# EAGLE design untitled (EAGLE 9.6.2)
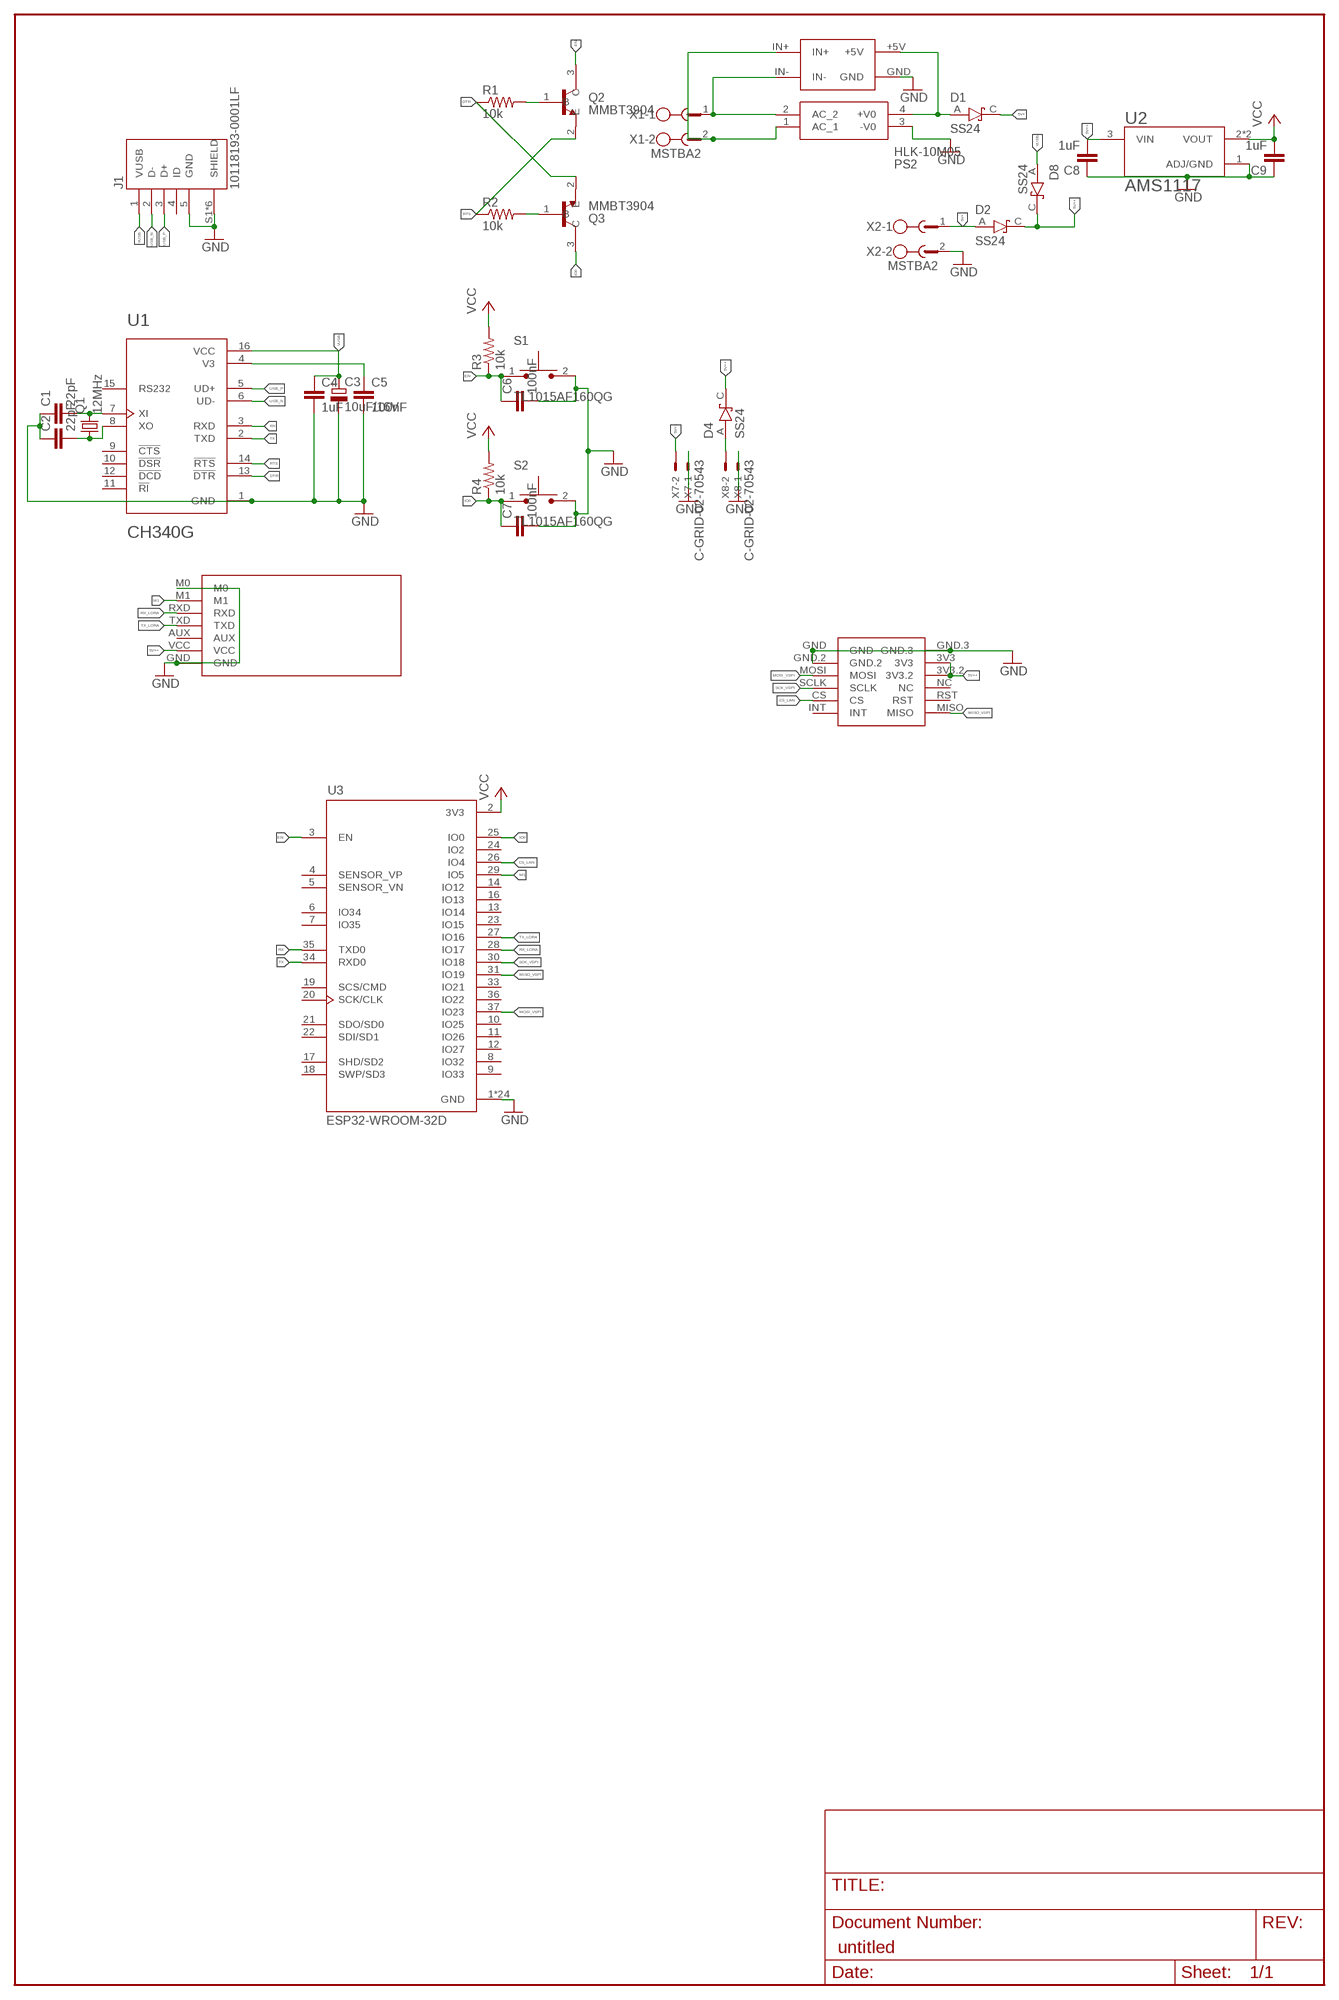
[diagram p0: schematic, sheet 1]

## Parts
C1  22pF  C-EUC0805K  [C0805K]
C2  22pF  C-EUC0805K  [C0805K]
C3  10uF/16V  CPOL-EU153CLV-0505  [153CLV-0505]
C4  1uF  C-EUC0805K  [C0805K]
C5  100nF  C-EUC0805K  [C0805K]
C6  100nF  C-EUC0805K  [C0805K]
C7  100nF  C-EUC0805K  [C0805K]
C8  1uF  C-EUC0805K  [C0805K]
C9  1uF  C-EUC0805K  [C0805K]
D1  SS24  [DIOM5336X265N]
D2  SS24  [DIOM5336X265N]
D4  SS24  [DIOM5336X265N]
D8  SS24  [DIOM5336X265N]
EBYTEE220-900T22D1  EBYTEE220-900T22D  [EBYTEE220-900T22D]
J1  10118193-0001LF  [FCI_10118193-0001LF]
PS2  HLK-10M05  [HLK10M05]
Q1  12MHz  CRYSTALSM49  [SM49]
Q2  MMBT3904  [SOT95P240X120-3N]
Q3  MMBT3904  [SOT95P240X120-3N]
R1  10k  R-US_M0805  [M0805]
R2  10k  R-US_M0805  [M0805]
R3  10k  R-US_M0805  [M0805]
R4  10k  R-US_M0805  [M0805]
S1  TL1015AF160QG  [SW_TL1015AF160QG]
S2  TL1015AF160QG  [SW_TL1015AF160QG]
SUPER-STEPDOWN1  SUPER-STEPDOWN  [SUPER-STEPDOWN]
U1  CH340G  [SOIC127P600X180-16N]
U2  AMS1117  [SOT229P700X180-4N]
U3  ESP32-WROOM-32D  [MODULE_ESP32-WROOM-32D]
U$1  MINI_W5500  [MINI_W5500]
X1  MSTBA2  [MSTBA2]
X2  MSTBA2  [MSTBA2]
X7  C-GRID-02-70543  [70543-02]
X8  C-GRID-02-70543  [70543-02]

## Nets
5V+: D1.C(K) D2.A X2.1 X7.2
5V++: C8.2 D2.C(K) D4.C(K) D8.C(K) EBYTEE220-900T22D1.VCC U2.3(VIN) U$1.3V3 U$1.3V3.2
CS_LAN: U3.26(IO4) U$1.CS
DTR: Q3.2(E) R1.1 U1.13(!DTR)
EN: C6.1 Q2.3(C) R3.1 S1.1 U3.3(EN)
GND(VERSION1): C1.1 C2.1 C3.- C4.2 C5.2 C6.2 C7.2 C8.1 C9.1 EBYTEE220-900T22D1.GND EBYTEE220-900T22D1.M0 J1.5(GND) J1.S1(SHIELD) J1.S2(SHIELD) J1.S3(SHIELD) J1.S4(SHIELD) J1.S5(SHIELD) J1.S6(SHIELD) PS2.3(-V0) S1.2 S2.2 SUPER-STEPDOWN1.GND U1.1(GND) U2.1(ADJ/GND) U3.1(GND) U3.15(GND) U3.38(GND) U3.39_1(GND) U3.39_2(GND) U3.39_3(GND) U3.39_4(GND) U3.39_5(GND) U3.39_6(GND) U3.39_7(GND) U3.39_8(GND) U3.39_9(GND) U3.39_10(GND) U3.39_11(GND) U3.39_12(GND) U3.39_13(GND) U3.39_14(GND) U3.39_15(GND) U3.39_16(GND) U3.39_17(GND) U3.39_18(GND) U3.39_19(GND) U3.39_20(GND) U3.39_21(GND) U$1.GND U$1.GND.2 U$1.GND.3 X2.2 X7.1 X8.1 ; supply symbol labelled GND
IO0: C7.1 Q3.3(C) R4.1 S2.1 U3.25(IO0)
M1: EBYTEE220-900T22D1.M1 U3.29(IO5)
MISO_VSPI: U3.31(IO19) U$1.MISO
MOSI_VSPI: U3.37(IO23) U$1.MOSI
N$1: PS2.2(AC_2) SUPER-STEPDOWN1.IN- X1.1
N$2: C5.1 U1.4(V3)
N$3: Q2.1(B) R1.2
N$4: C1.2 Q1.2 U1.7(XI)
N$5: C2.2 Q1.1 U1.8(XO)
N$6: Q3.1(B) R2.2
N$7: PS2.1(AC_1) SUPER-STEPDOWN1.IN+ X1.2
N$8: D1.A PS2.4(+V0) SUPER-STEPDOWN1.+5V
N$12: D4.A X8.2
RTS: Q2.2(E) R2.1 U1.14(!RTS)
RX: U1.3(RXD) U3.35(TXD0)
RX_LORA: EBYTEE220-900T22D1.RXD U3.28(IO17)
SCK_VSPI: U3.30(IO18) U$1.SCLK
TX: U1.2(TXD) U3.34(RXD0)
TX_LORA: EBYTEE220-900T22D1.TXD U3.27(IO16)
USB_N: J1.2(D-) U1.6(UD-)
USB_P: J1.3(D+) U1.5(UD+)
VCC: C9.2 R3.2 R4.2 U2.2(VOUT) U2.4(VOUT) U3.2(3V3)
VUSB: C3.+ C4.1 D8.A J1.1(VUSB) U1.16(VCC)
Unconnected: EBYTEE220-900T22D1.AUX J1.4(ID) U1.9(!CTS) U1.10(!DSR) U1.11(!RI) U1.12(!DCD) U1.15(RS232) U3.4(SENSOR_VP) U3.5(SENSOR_VN) U3.6(IO34) U3.7(IO35) U3.8(IO32) U3.9(IO33) U3.10(IO25) U3.11(IO26) U3.12(IO27) U3.13(IO14) U3.14(IO12) U3.16(IO13) U3.17(SHD/SD2) U3.18(SWP/SD3) U3.19(SCS/CMD) U3.20(SCK/CLK) U3.21(SDO/SD0) U3.22(SDI/SD1) U3.23(IO15) U3.24(IO2) U3.33(IO21) U3.36(IO22) U$1.INT U$1.NC U$1.RST

## Library data of the parts
C1 C2 C4-C9 = rcl:C-EU: CAPACITOR, European symbol; SPICEPREFIX: C
C3 = rcl:CPOL-EU: POLARIZED CAPACITOR, European symbol; SPICEPREFIX: C
D1 D2 D4 D8 = SS24:SS24: Diode Schottky 40V 2A Surface Mount DO-214AA (SMB) Check availability <https://pricing.snapeda.com/parts/SS24/ON%20Semiconductor/view-part?ref=eda>; AVAILABILITY: In Stock; CHECK_PRICES: https://www.snapeda.com/parts/SS24/Onsemi/view-part/?ref=eda; DESCRIPTION: Diode Schottky 40V 2A Surface Mount DO-214AA (SMB); MF: ON Semiconductor; MP: SS24; PACKAGE: DO-214AA ON Semiconductor; PRICE: None; SNAPEDA_LINK: https://www.snapeda.com/parts/SS24/Onsemi/view-part/?ref=snap
EBYTEE220-900T22D1 = EByte E220-900T22D:EBYTEE220-900T22D
J1 = 10118193-0001LF:10118193-0001LF: Micro USB B Type Receptacle Check availability <https://pricing.snapeda.com/parts/10118193-0001LF/FCI/view-part?ref=eda>; AVAILABILITY: In Stock; DESCRIPTION: USB - micro B USB 2.0 Receptacle Connector 5 Position Surface Mount, Right Angle; Through Hole; MF: FCI; MP: 10118193-0001LF; PACKAGE: None; PRICE: None; PURCHASE-URL: https://pricing.snapeda.com/search/part/10118193-0001LF/?ref=eda
PS2 = HLK-10M05:HLK-10M05: HI-LINK HLK-10M05 Manufacturer : HI-LINK <https://lcsc.com//brand-detail/11515.html> Mfr.Part # HLK-10M05 LCSC Part # C403745 <https://lcsc.com/product-detail/show_C403745.html> Package : Through Hole Datasheet :  EasyEDA Model <javascript:void(0);> Power Module AC-DC Through Hole RoHS Source: Datasheet <https://datasheet.lcsc.com/szlcsc/1909111105_HI-LINK-HLK-10M05_C403745.pdf> Check availability <https://pricing.snapeda.com/parts/HLK-10M05/Hi-link/view-part?ref=eda>; AVAILABILITY: Not in stock; DESCRIPTION: 10W Ultra-Compact Power Module; MF: Hi-link; MP: HLK-10M05; PACKAGE: Package; PRICE: None
Q1 = crystal:CRYSTAL: CRYSTAL; OC_FARNELL: unknown; OC_NEWARK: unknown
Q2 Q3 = MMBT3904:MMBT3904: MMBT3904 Series 40 V CE Breakdown 0.2 A NPN General Purpose Amplifier - SOT-23 Check availability <https://pricing.snapeda.com/parts/MMBT3904/ON%20Semiconductor/view-part?ref=eda>; AVAILABILITY: In Stock; DESCRIPTION: Bipolar (BJT) Transistor NPN 40 V 200 mA 300MHz 300 mW Surface Mount SOT-23-3 (TO-236); MF: ON Semiconductor; MP: MMBT3904; PACKAGE: SOT-23-3 Motorola; PRICE: None
R1-R4 = rcl:R-US_: RESISTOR, American symbol; SPICEPREFIX: R
S1 S2 = TL1015AF160QG:TL1015AF160QG: Tactile Switch SPST-NO Top Actuated Surface Mount Check availability <https://pricing.snapeda.com/parts/TL1015AF160QG/E-Switch/view-part?ref=eda>; AVAILABILITY: In Stock; DESCRIPTION: Tactile Switch SPST-NO Top Actuated Surface Mount; MF: E-Switch; MP: TL1015AF160QG; PACKAGE: None; PRICE: None; PURCHASE-URL: https://pricing.snapeda.com/search/part/TL1015AF160QG/?ref=eda
SUPER-STEPDOWN1 = SUPER-STEPDOWN:SUPER-STEPDOWN
U1 = CH340G:CH340G: Check availability <https://pricing.snapeda.com/parts/Ch340G/WCH/view-part?ref=eda>; AVAILABILITY: Not in stock; DESCRIPTION: USB Interface Integrated Circuit; MF: WCH; MP: Ch340G; PACKAGE: None; PRICE: None
U2 = AMS1117:AMS1117: Sot223/Pkg 1-Amp 5-Volt Low Drop Out Voltage Regulatator Check availability <https://pricing.snapeda.com/parts/AMS1117/Advanced%20Monolithic%20Systems/view-part?ref=eda>; AVAILABILITY: Not in stock; DESCRIPTION: 1A LOW DROPOUT VOLTAGE REGULATOR SOT-223; MF: Advanced Monolithic Systems; MP: AMS1117; PACKAGE: SOT-223 Seeed Technology; PRICE: None
U3 = ESP32-WROOM-32D:ESP32-WROOM-32D: Bluetooth, WiFi 802.11b/g/n, Bluetooth v4.2 + EDR, Class 1, 2 and 3 Transceiver Module 2.4GHz ~ 2.5GHz Integrated, Trace Surface Mount Check availability <https://pricing.snapeda.com/parts/ESP32-WROOM-32D/Espressif%20Systems/view-part?ref=eda>; AVAILABILITY: In Stock; DESCRIPTION: Bluetooth, WiFi 802.11b/g/n, Bluetooth v4.2 +EDR, Class 1, 2 and 3 Transceiver Module 2.4GHz ~ 2.5GHz Integrated; MF: Espressif Systems; MP: ESP32-WROOM-32D; PACKAGE: Module Espressif Systems; PRICE: None; PURCHASE-URL: https://pricing.snapeda.com/search/part/ESP32-WROOM-32D/?ref=eda
U$1 = ethernet-mikroavr:MINI_W5500: MINI ETHERNET W5500, CREATE BY MIKROAVR.COM
X1 X2 = con-phoenix-508:MSTBA2: PHOENIX; MF: FARNELL; MPN: 1757242; OC_FARNELL: 3705171; OC_NEWARK: 71C4161
X7 X8 = con-molex:C-GRID-02: CONNECTOR wire to board 2.54 mm (0.100") pitch header; MF: MOLEX; OC_FARNELL: unknown; OC_NEWARK: unknown

## Board
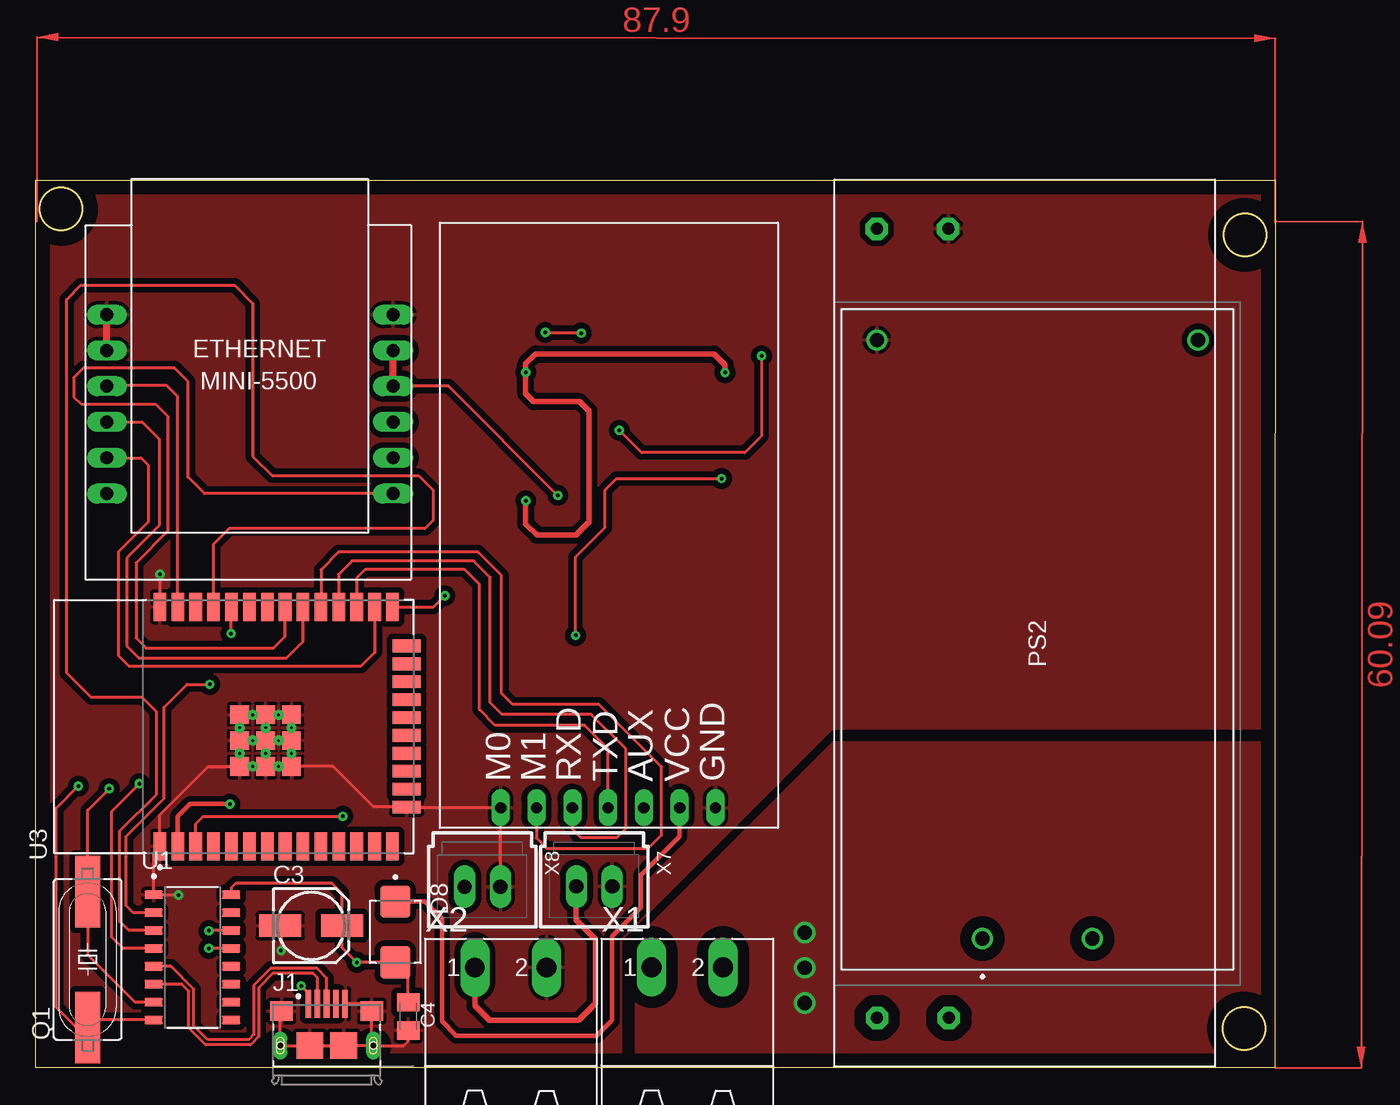
[diagram p1: board, top side]
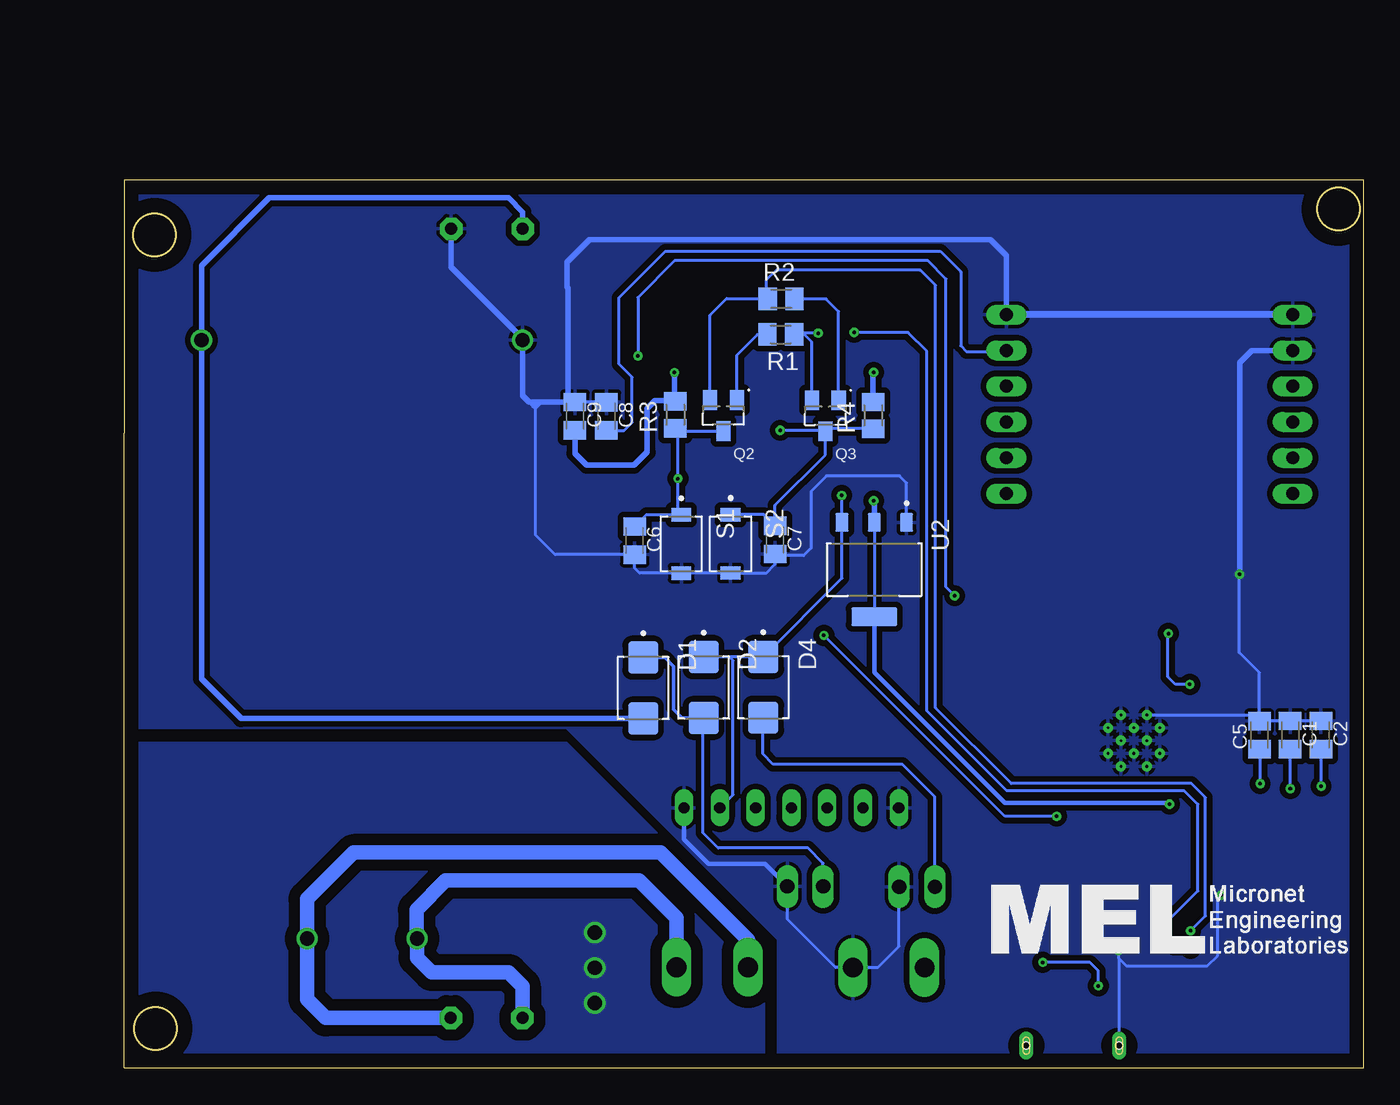
[diagram p2: board, bottom side, seen from below]

Size 88.01 x 63 mm. Coordinates in mm from the lower left corner, seen from the top.
Outline: 0,63 88,63 88,45.07 88.01,45.07 88.01,13.57 88,13.57 88,0 0,0 0,63
Outline: circle at 85.78,2.78 radius 1.5
Outline: circle at 85.85,59.13 radius 1.5
Outline: circle at 1.81,60.96 radius 1.5
Copper layers (1*16): Top 0.035mm / dielectric 1.5mm / Bottom 0.035mm
Design rules "default *": minimum track width 6mil, minimum drill 0.25mm, track to track 6mil, track to pad 6mil, pad to pad 6mil, via to via 6mil, smd to smd 6mil, copper to edge 40mil, drill to drill 6mil, minimum pad ring 10mil, minimum via ring 8mil, stop-mask expansion 4mil, vias tented up to drill 0mil, thermal gap 10mil

### Footprints (pad centres in the part's own frame; a part is rotated, then mirrored left to right if it is on the bottom)
C0805K = smd 1.3 x 1.6: 1 -1,0; 2 1,0
153CLV-0505 = smd 3 x 1.6: + 2.2,0; - -2.2,0
DIOM5336X265N = smd 2.29 x 2.12: A 2.16,0; C -2.16,0
EBYTEE220-900T22D = drill 0.8 pad 1.27 long: AUX -4.56,-10.98; GND -4.56,-16.06; M0 -4.56,-0.82; M1 -4.56,-3.36; RXD -4.56,-5.9; TXD -4.56,-8.44; VCC -4.56,-13.52
FCI_10118193-0001LF = smd 0.4 x 2: 1 -1.3,2.975; 2 -0.65,2.975; 3 0,2.975; 4 0.65,2.975; 5 1.3,2.975 | smd 1.6 x 1.4: S1 -3.2,2.45; S2 3.2,2.45 | smd 1.9 x 1.9: S3 1.2,0; S4 -1.2,0 | drill 0.5 pad 0.9 long: S5 -3.3,0; S6 3.3,0 | hole 0.5: -3.3,0; 3.3,0
HLK10M05 = drill 1 pad 1.5: 1 0,0; 2 0,-7.8; 3 42.5,7.5; 4 42.5,-15.3
SM49 = smd 5.08 x 1.778: 1 -4.826,0; 2 4.826,0
SOT95P240X120-3N = smd 1 x 1.4: 1 -0.95,-1.1; 2 0.95,-1.1; 3 0,1.1
M0805 = smd 1.3 x 1.6: 1 -0.95,0; 2 0.95,0
SW_TL1015AF160QG = smd 0.95 x 1.4: 1 -2.075,0; 2 2.075,0
SUPER-STEPDOWN = drill 0.85 pad 1.6 octagon: +5V 59.509,24.006; GND 59.509,18.926; IN+ 3.478,23.979; IN- 3.478,18.899
SOIC127P600X180-16N = smd 1.31 x 0.62: 1 -2.75,4.445; 2 -2.75,3.175; 3 -2.75,1.905; 4 -2.75,0.635; 5 -2.75,-0.635; 6 -2.75,-1.905; 7 -2.75,-3.175; 8 -2.75,-4.445; 9 2.75,-4.445; 10 2.75,-3.175; 11 2.75,-1.905; 12 2.75,-0.635; 13 2.75,0.635; 14 2.75,1.905; 15 2.75,3.175; 16 2.75,4.445
SOT229P700X180-4N = smd 1.31 x 0.93: 1 -3.345,2.29; 2 -3.345,0; 3 -3.345,-2.29 | smd 1.31 x 3.24: 4 3.345,0
MODULE_ESP32-WROOM-32D = smd 2 x 0.9: 1 -8.5,5.26; 2 -8.5,3.99; 3 -8.5,2.72; 4 -8.5,1.45; 5 -8.5,0.18; 6 -8.5,-1.09; 7 -8.5,-2.36; 8 -8.5,-3.63; 9 -8.5,-4.9; 10 -8.5,-6.17; 11 -8.5,-7.44; 12 -8.5,-8.71; 13 -8.5,-9.98; 14 -8.5,-11.25; 25 8.5,-11.25; 26 8.5,-9.98; 27 8.5,-8.71; 28 8.5,-7.44; 29 8.5,-6.17; 30 8.5,-4.9; 31 8.5,-3.63; 32 8.5,-2.36; 33 8.5,-1.09; 34 8.5,0.18; 35 8.5,1.45; 36 8.5,2.72; 37 8.5,3.99; 38 8.5,5.26 | smd 0.9 x 2: 15 -5.715,-12.25; 16 -4.445,-12.25; 17 -3.175,-12.25; 18 -1.905,-12.25; 19 -0.635,-12.25; 20 0.635,-12.25; 21 1.905,-12.25; 22 3.175,-12.25; 23 4.445,-12.25; 24 5.715,-12.25 | smd 1.33 x 1.33: 39_1 -2.835,-0.405; 39_2 -1,-0.405; 39_3 0.835,-0.405; 39_4 -2.835,-2.24; 39_5 -1,-2.24; 39_6 0.835,-2.24; 39_7 -2.835,-4.075; 39_8 -1,-4.075; 39_9 0.835,-4.075 | drill 0.2 pad 0.3: 39_10 -1.917,-0.405; 39_11 -0.083,-0.405; 39_12 -2.835,-1.323; 39_13 -1,-1.323; 39_14 0.835,-1.323; 39_15 -1.917,-2.24; 39_16 -0.083,-2.24; 39_17 -2.835,-3.158; 39_18 -1,-3.158; 39_19 0.835,-3.158; 39_20 -1.917,-4.075; 39_21 -0.083,-4.075
MINI_W5500 = drill 0.914 long: 3V3 21.844,-8.89; 3V3.2 21.844,-11.43; CS 1.524,-16.51; GND 1.524,-6.35; GND.2 1.524,-8.89; GND.3 21.844,-6.35; INT 1.524,-19.05; MISO 21.844,-19.05; MOSI 1.524,-11.43; NC 21.844,-13.97; RST 21.844,-16.51; SCLK 1.524,-13.97
MSTBA2 = drill 1.397 long: 1 -2.54,5.08; 2 2.54,5.08
70543-02 = drill 1.016 long: 1 -1.27,0; 2 1.27,0

### Placement (x,y rotation side)
C1  5.24,23.61 270 bottom
C2  3.05,23.62 270 bottom
C3  19.56,10.08 0 top
C4  26.46,3.65 270 top
C5  7.41,23.6 90 bottom
C6  51.78,37.42 270 bottom
C7  41.79,37.47 270 bottom
C8  53.77,46.25 270 bottom
C9  56.01,46.26 270 bottom
D1  51.16,26.95 270 bottom
D2  46.88,26.99 270 bottom
D4  42.63,27.01 270 bottom
D8  25.53,9.63 270 top
EBYTEE220-900T22D1  32.2,23.01 90 top
J1  20.66,1.56 0 top
PS2  67.22,9.16 90 top
Q1  3.7,7.69 90 top
Q2  45.47,46.3 180 bottom
Q3  38.23,46.28 180 bottom
R1  41.39,52.05 180 bottom
R2  41.38,54.58 0 bottom
R3  48.88,46.35 90 bottom
R4  34.84,46.31 90 bottom
S1  48.46,37.18 270 bottom
S2  44.96,37.19 270 bottom
SUPER-STEPDOWN1  83.72,0.05 90 top
U1  11.14,7.83 0 top
U2  34.76,35.36 270 bottom
U3  14.08,24.22 90 top
U$1  3.53,59.81 0 top
X1  46.26,2.05 0 top
X2  33.73,2.04 0 top
X7  39.66,12.87 180 top
X8  31.73,12.84 180 top

### Tracks (layer width: path | path; a pad name or v marks a point on that pad's centre or on a via)
5V+
  Top 0.406: X2.1 31.19,4.38 32.22,3.35 38.53,3.35 39.75,4.57 39.75,9.11 38.35,10.51 38.35,12.83 X7.2
  Bottom 0.203: D2.A 46.91,24.8 46.91,16.66 45.84,15.59 39.46,15.59 38.39,14.52 X7.2 | 51.15,29.13 D1.C
  Bottom 0.254: D2.A 48.4,24.83 49.01,25.44 49.01,28.5 49.62,29.11 D1.C
5V++  (via drill 0.25)
  Top 0.203: U$1.3V3.2 29.31,48.38 37.06,40.63 v37.08,40.63
  Top 0.305: EBYTEE220-900T22D1.VCC 45.72,16.43 42.97,13.68 42.97,11.38 40.93,9.34 40.93,3.37 39.82,2.26 29.86,2.26 28.84,3.28 28.84,10.61 27.63,11.82 25.55,11.82 D8.C
  Top 0.508: U$1.3V3.2 U$1.3V3
  Bottom 0.203: 45.04,29.17 D4.C 37.05,34.75 U2.3 37.05,40.6 v37.08,40.63 | 45.04,29.17 46.86,29.17 D2.C | EBYTEE220-900T22D1.VCC 44.78,19.38 44.78,28.91 45.04,29.17 | C8.2 52.51,45.24 51.95,45.81 51.95,49.03 52.88,49.96 52.88,54.67 49.59,57.96 30.07,57.96 28.62,56.51 28.62,51.25 28.2,50.83 25.46,50.83 U$1.3V3
CS_LAN
  Top 0.203: U$1.CS 7.48,43.3 8,42.78 8,38.74 5.87,36.62 5.87,29.26 6.62,28.51 23.1,28.51 24.1,29.51 24.1,32.68 U3.26
DTR  (via drill 0.25)
  Top 0.203: U1.13 v12.31,8.46 12.29,8.44 | v36.18,52.2 38.69,52.2 v38.74,52.15
  Bottom 0.203: Q3.2 39.18,51.53 39.71,52.05 R1.1 40.34,52.15 v38.74,52.15 | v12.31,8.46 13.5,8.46 14.07,9.03 14.07,10.27 11.79,12.55 11.79,18.7 12.75,19.66 25.35,19.66 31.02,25.33 31.02,50.86 32.36,52.2 v36.18,52.2
EN  (via drill 0.25)
  Top 0.203: U3.3 11.36,17.29 11.89,17.82 21.78,17.82 v21.8,17.85 | v38.34,30.69 38.34,36.27 40.41,38.35 40.41,41.01 41.23,41.82 v48.69,41.82 48.71,41.82
  Bottom 0.203: R3.1 48.69,45.21 | 48.69,45.21 48.69,45.2 Q2.3 | C6.1 50.93,39.26 S1.1 48.69,39.5 v48.69,41.82 48.69,45.21 | v21.8,17.85 25.47,17.85 38.31,30.69 v38.34,30.69
GND1  (via drill 1)
  other vias: 54.6,4.59 54.6,7.09 54.6,9.59
  pour Bottom (isolate 0.813): 42.6,0.09 88.1,0.09 88.1,23.09 56.6,23.09 42.6,9.09
  pour Top (isolate 0.813): 42.6,0.09 88.1,0.09 88.1,23.09 56.6,23.09 42.6,9.09
GND(VERSION1)  (via drill 0.25)
  Top 0.203: J1.S6 23.86,1.66 J1.S2 23.34,4.54 J1.5 | J1.S6 26.14,1.56 26.46,1.89 C4.2 | J1.S6 J1.S3 J1.S4 J1.S5 17.36,3.91 J1.S1 | U3.39_3 U3.39_14 U3.39_6 16.4,25.05 | U3.39_3 | 16.4,25.05 U3.39_19 18.15,25.05 | 18.15,25.05 U3.39_9 | 18.15,25.05 18.15,24.15 U3.39_21 U3.39_8 18,23.22 | 16.4,25.05 16.32,24.98 U3.39_16 U3.39_5 | U3.39_3 14.49,25.04 U3.39_11 14.49,23.25 | 14.49,23.25 U3.39_2 | 14.55,23.22 U3.39_13 U3.39_5 | 14.55,23.22 14.52,23.22 14.49,23.25 | U3.39_5 16.39,23.22 | 16.39,23.22 U3.39_18 18,23.22 | 18,23.22 18,22.46 U3.39_20 U3.39_7 | 16.39,23.22 16.32,23.15 U3.39_15 U3.39_4 | U3.39_4 U3.39_17 U3.39_7 | 14.55,23.22 14.49,23.16 U3.39_10 U3.39_1 | U3.39_1 U3.39_12 U3.39_4 | X8.1 33,18.42 EBYTEE220-900T22D1.M0 27.09,18.45 26.86,18.68 26.51,18.68 U3.15 24,18.5 21.12,21.38 U3.39_7 | U3.39_1 12.26,21.38 8.82,17.95 U3.1 8.39,15.28 U1.1 8.42,12.25 v10.13,12.25 | C3.- 17.43,10.01 v17.43,8.31 | v8.82,35.03 | v8.82,35.03 U3.38
  Top 0.508: U$1.GND.2 U$1.GND
  Bottom 0.2: 58.82,46.78 59,46.97 | 59,46.97 59.25,47.21 59.25,47.26 | 58.62,46.97 59,46.97
  Bottom 0.203: C8.1 56,47.24 C9.1 | C2.1 C1.1 C5.2 | U2.1 32.47,41.52 32.96,42.01 38.16,42.01 39.25,40.92 39.25,36.88 39.78,36.35 41.12,36.35 41.24,36.47 C7.2 41.8,35.75 42.42,35.12 S2.2 48.45,35.12 S1.2 51.41,35.11 51.78,35.47 C6.2 57.4,36.42 58.82,37.83 58.82,46.78 58.62,46.97 58.34,47.26 | v17.43,8.31 17.43,7.79 17.36,7.73 | 17.36,7.73 16.85,7.22 11.12,7.22 10.38,7.96 10.38,12 v10.13,12.25 | J1.S5 17.36,7.73 | U3.39_14 7.74,25.05 7.31,24.62 7.39,24.62 C5.2 | C5.2 7.41,28.04 8.85,29.48 8.85,35 v8.82,35.03 | X8.1 33,8.62 34.5,7.11 X2.2 37.51,7.11 40.93,10.53 X7.1
  Bottom 0.305: EBYTEE220-900T22D1.GND 48.26,16.21 46.51,14.46 42.52,14.46 X7.1
  Bottom 0.406: v8.82,35.03 8.82,50.07 7.97,50.92 U$1.GND.2 | U$1.GND.3 25.38,57.66 26.5,58.78 54.96,58.78 56.55,57.19 56.55,55.43 56.48,55.36 56.48,47.73 C9.1 58.34,47.26 59.25,47.26 59.72,47.73 PS2.3 59.72,51.76 64.8,56.83 SUPER-STEPDOWN1.GND
  Bottom 0.508: U$1.GND U$1.GND.3
  pour Top (isolate 0.406): 0.1,0.09 41.6,0.09 41.6,9.09 56.6,24.09 88.1,24.09 88.1,63.09 0.1,63.09
  pour Bottom (isolate 0.406): 0.1,0.09 41.6,0.09 41.6,9.09 56.6,24.09 88.1,24.09 88.1,63.09 0.1,63.09
IO0  (via drill 0.25)
  Top 0.203: U3.25 28.26,32.72 v29.05,33.5 | v51.53,50.54 51.53,44.85 50.34,43.65 43.03,43.65 v41.43,45.25
  Bottom 0.203: R4.1 38.06,45.36 Q3.3 | S2.1 42.59,39.27 C7.1 41.8,39.94 38.23,43.51 Q3.3 | v29.05,33.5 29.67,34.12 29.67,56 30.95,57.28 48.94,57.28 51.53,54.69 v51.53,50.54 | v41.43,45.25 38.3,45.25 Q3.3
M1
  Top 0.203: EBYTEE220-900T22D1.M1 35.56,16.3 36.29,15.57 43.48,15.57 44.44,16.52 44.44,21.36 40,25.8 33.86,25.8 33.08,26.58 33.08,34.93 31.39,36.61 21.52,36.61 20.25,35.34 U3.29
MISO_VSPI
  Top 0.203: U$1.MISO 12,40.76 10.83,41.93 10.83,48.7 9.86,49.66 3.37,49.66 2.72,49.01 2.72,47.63 3.25,47.1 8.54,47.1 9.39,46.25 9.39,38.1 7.12,35.84 7.12,30.51 7.85,29.79 16.89,29.79 17.71,30.61 U3.31
MOSI_VSPI
  Top 0.203: U3.37 10.09,47.64 9.29,48.44 5.12,48.44 U$1.MOSI
N$1
  Bottom 1.016: X1.1 43.72,9.08 49.92,15.28 71.72,15.28 75.02,11.97 PS2.2 75.03,9.15 75.03,4.86 73.7,3.53 SUPER-STEPDOWN1.IN-
N$2  (via drill 0.25)
  Top 0.203: U1.4 6.21,8.46 5.4,9.27 5.4,18.19 7.37,20.15 | 7.37,20.15 | 7.37,20.15 v7.36,20.16
  Bottom 0.203: v7.36,20.16 7.36,22.56 C5.1
N$3
  Bottom 0.203: Q2.1 44.52,50.59 43.06,52.05 R1.2
N$4  (via drill 0.25)
  Top 0.203: U1.7 7.06,4.65 3.69,8.02 3.69,12.5 Q1.2 3.7,18.28 v5.22,19.8
  Bottom 0.203: v5.22,19.8 5.22,22.6 C1.2
N$5  (via drill 0.25)
  Top 0.203: U1.8 4.22,3.38 Q1.1 2.87,2.86 1.45,4.28 1.45,18.41 v3.03,19.99
  Bottom 0.203: v3.03,19.99 3.03,22.6 C2.2
N$6
  Bottom 0.203: Q3.1 37.28,53.68 38.18,54.58 R2.2
N$7
  Bottom 1.016: X1.2 48.8,10.64 51.45,13.29 65.18,13.29 67.26,11.21 67.26,9.2 PS2.1 67.22,7.8 66.18,6.76 60.71,6.76 59.74,5.79 SUPER-STEPDOWN1.IN+
N$8
  Bottom 0.406: D1.A 79.71,24.79 82.52,27.6 PS2.4 82.52,56.93 77.7,61.75 60.73,61.75 59.72,60.74 SUPER-STEPDOWN1.+5V
N$12
  Bottom 0.203: X8.2 30.46,19.23 32.77,21.55 41.94,21.55 42.66,22.26 42.66,24.82 D4.A
RTS  (via drill 0.25)
  Top 0.203: U1.14 12.33,9.73 v12.31,9.72
  Bottom 0.203: Q2.2 46.42,53.43 45.24,54.61 42.43,54.61 | 42.43,54.61 42.37,54.61 R2.1 | v12.31,9.72 11.25,10.77 11.25,19.18 12.25,20.17 25.04,20.17 30.41,25.54 30.41,55.54 31.48,56.62 41.71,56.62 42.43,55.9 42.43,54.61
RX
  Top 0.203: U1.3 6.61,9.73 5.96,10.38 5.96,16.79 8.58,19.41 8.58,25.27 7.56,26.29 3.94,26.29 2.19,28.03 2.19,54.54 3.2,55.55 14.14,55.55 15.43,54.26 15.43,43.4 16.81,42.02 27.2,42.02 28.21,41.01 28.21,38.84 27.64,38.27 13.73,38.27 12.61,37.15 12.61,32.74 U3.35
RX_LORA
  Top 0.203: EBYTEE220-900T22D1.RXD 38.1,16.94 38.7,16.34 41.26,16.34 41.9,16.97 41.9,22.64 39.45,25.1 33.1,25.1 32.28,25.92 32.28,34.8 31.1,35.98 22.46,35.98 21.51,35.02 21.51,32.73 U3.28
SCK_VSPI
  Top 0.203: U$1.SCLK 7.55,45.84 8.77,44.62 8.77,38.48 6.47,36.18 6.47,29.95 7.32,29.09 17.82,29.09 18.98,30.25 U3.30
TX  (via drill 0.25)
  Top 0.203: U1.2 6.93,11 6.45,11.48 6.45,16.44 9.12,19.11 9.12,25.58 10.75,27.21 v12.36,27.21 | v13.88,30.82 13.88,32.69 U3.34
  Bottom 0.203: v12.36,27.21 13.37,27.21 13.9,27.74 13.9,30.8 v13.88,30.82
TX_LORA
  Top 0.203: EBYTEE220-900T22D1.TXD 40.64,22.64 38.97,24.31 32.62,24.31 31.51,25.42 31.51,34.31 30.45,35.37 23.39,35.37 22.79,34.77 U3.27
USB_N
  Top 0.203: J1.2 20.01,6.37 19.7,6.68 16.84,6.68 15.84,5.68 15.84,2.21 15.36,1.73 | 15.36,1.73 | 15.36,1.73 15.26,1.62 12.08,1.62 10.87,2.83 10.87,5.43 10.37,5.93 U1.6
USB_P
  Top 0.203: J1.3 20.66,6.36 19.98,7.04 16.7,7.04 15.49,5.83 15.49,2.36 15.11,1.98 12.23,1.98 11.23,2.98 11.23,5.58 9.61,7.19 U1.5
VCC  (via drill 0.25)
  Top 0.305: v13.79,18.72 10.97,18.72 10.09,17.84 U3.2
  Top 0.406: v34.8,40.26 34.8,38.6 35.59,37.81 38.35,37.81 39.28,38.73 39.28,46.63 38.62,47.29 35.36,47.29 34.8,47.85 v34.8,49.37 34.8,49.98 35.49,50.68 48.15,50.68 48.94,49.88 v48.94,49.36
  Bottom 0.203: U2.2 U2.4
  Bottom 0.305: U2.4 34.76,28.06 25.5,18.8 13.87,18.8 v13.79,18.72
  Bottom 0.406: C9.2 56.01,43.61 55.18,42.77 51.82,42.77 50.89,43.7 50.89,46.78 50.33,47.35 48.93,47.35 R3.2 48.94,47.36 v48.94,49.36 | U2.2 34.76,40.18 34.81,40.24 | 34.81,40.24 | 34.81,40.24 v34.8,40.26 | v34.8,49.37 34.84,49.33 R4.2
VUSB  (via drill 0.25)
  Top 0.203: C4.1 26.46,6.54 D8.A v22.8,7.47 21.76,8.5 C3.+ 21.76,12.37 21.03,13.1 14.2,13.1 13.89,12.78 U1.16 | J1.1 19.36,5.3 v18.86,5.81 v18.85,5.81
  Bottom 0.203: v18.85,5.81 18.85,6.89 19.44,7.48 22.87,7.48 22.86,7.47 v22.8,7.47
(copper drawn outside any net)
  shapes: Top area x2